# Altium schematic sheet LB-word-oscillator.SchDoc
size A4
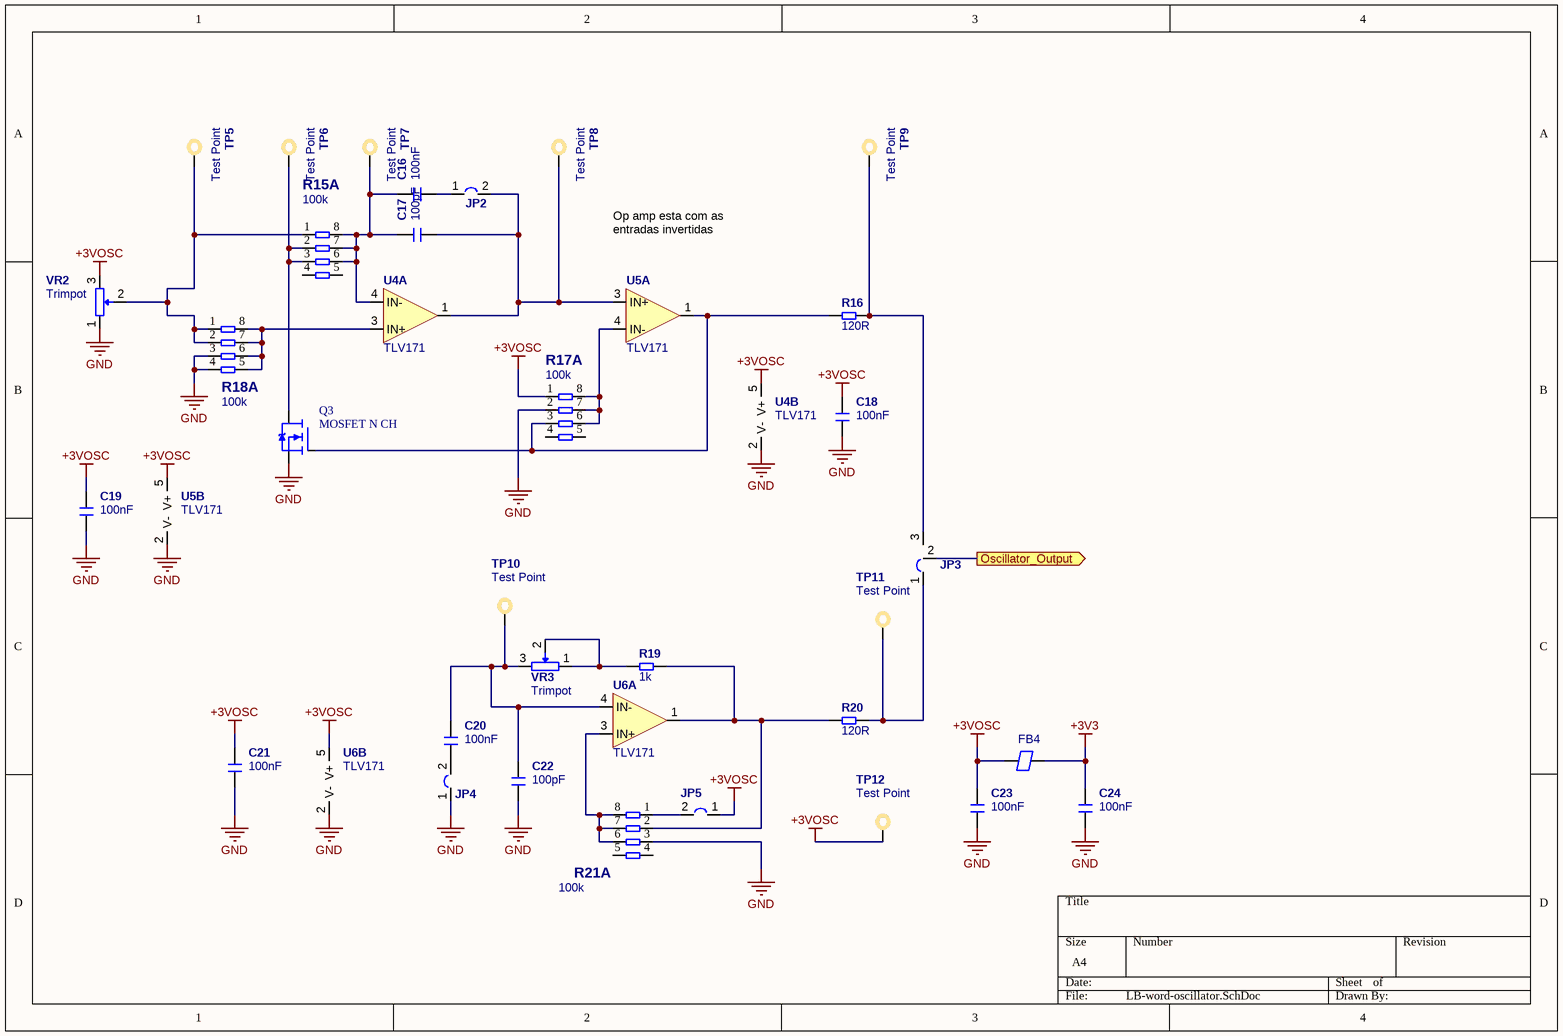
[diagram p0: LB-word-oscillator.SchDoc]

## Parts
C16  100nF  [C0603_N]
C17  100pF  [C0603_N]
C18  100nF  [C0603_N]
C19  100nF  [C0603_N]
C20  100nF  [C0603_N]
C21  100nF  [C0603_N]
C22  100pF  [C0603_N]
C23  100nF  [C0603_N]
C24  100nF  [C0603_N]
FB4  Ferrite Bead  [F0603_N]  (value not drawn)
JP2  Jumper 2W  [Jumper SMD 2W NO]  (value not drawn)
JP3  Jumper 3W  [Jumper SMD 3W NO]  (value not drawn)
JP4  Jumper 2W  [Jumper SMD 2W NO]  (value not drawn)
JP5  Jumper 2W  [Jumper SMD 2W NO]  (value not drawn)
Q3  MOSFET N CH  [SOT23_N]
R15  value 100k  [YC164]  (parts A,B,C,D of 4)
R16  120R  [R0603]
R17  value 100k  [YC164]  (parts A,B,C,D of 4)
R18  value 100k  [YC164]  (parts A,B,C,D of 4)
R19  1k  [R0603]
R20  120R  [R0603]
R21  value 100k  [YC164]  (parts A,B,C,D of 4)
TP5  Test Point  [TestPoint-1.2mm]
TP6  Test Point  [TestPoint-1.2mm]
TP7  Test Point  [TestPoint-1.2mm]
TP8  Test Point  [TestPoint-1.2mm]
TP9  Test Point  [TestPoint-1.2mm]
TP10  Test Point  [TestPoint-1.2mm]
TP11  Test Point  [TestPoint-1.2mm]
TP12  Test Point  [TestPoint-1.2mm]
U4  TLV171  [SOT23-5_N]  (parts A,B of 2)
U5  TLV171  [SOT23-5_N]  (parts A,B of 2)
U6  TLV171  [SOT23-5_N]  (parts A,B of 2)
VR2  Trimpot  [Trimpot 3314]
VR3  Trimpot  [Trimpot 3314]

## Ports
Oscillator_Output (out)

## Nets
+3V3: C24.1 FB4.2
+3VOSC: C18.1 C19.1 C21.1 C23.1 FB4.1 JP5.1 R17.1 TP12.1 U4.5(V+) U5.5(V+) U6.5(V+) VR2.3
GND: C18.2 C19.2 C21.2 C22.2 C23.2 C24.2 JP4.1 Q3.3(S) R17.3 R17.4 R18.2 R21.3 U4.2(V-) U5.2(V-) U6.2(V-) VR2.1
Oscillator_Output: JP3.2 ; port Oscillator_Output
NetC16_1: C16.1 C17.1 R15.6 R15.7 R15.8 TP7.1 U4.4(IN-)
NetC16_2: C16.2 JP2.1
NetC17_2: C17.2 JP2.2 TP8.1 U4.1(OUT) U5.3(IN+)
NetC20_1: C20.1 C22.1 TP10.1 U6.4(IN-) VR3.3
NetC20_2: C20.2 JP4.2
NetJP3_1: JP3.1 R20.2 TP11.1
NetJP3_3: JP3.3 R16.2 TP9.1
NetJP5_2: JP5.2 R21.1
NetQ3_1: Q3.1(G) R16.1 R18.3 U5.1(OUT)
NetQ3_2: Q3.2(D) R15.2 R15.3 TP6.1
NetR15_1: R15.1 R17.2 R18.1 TP5.1 VR2.2
NetR17_5: R17.5 R17.6 R17.7 R18.8 U4.3(IN+)
NetR17_8: R17.8 R18.6 R18.7 U5.4(IN-)
NetR19_1: R19.1 VR3.1 VR3.2
NetR19_2: R19.2 R20.1 R21.2 U6.1(OUT)
NetR21_6: R21.6 R21.7 R21.8 U6.3(IN+)

Not connected (* = marked no-connect by the designer): R15 4 5; R18 4 5; R21 4 5

## Notes on the sheet
- (near U5) Op amp esta com as entradas invertidas

## Library data of the parts
C16-C24 = Capacitor: Capacitor MLCC; Manufacturer: Yageo; Manufacturer Part Number: CC0603KRX7R9BB104; Tolerance (%): 10; Category: Capacitor; Package: 0603; Supplier Part Number 1: 1362556; Supplier 1: Farnell; ComponentLink1URL: http://www.yageo.com; ComponentLink1Description: Manufacturer Website; Voltage Rating (Volts): *; Supplier 2: Digi-Key; Supplier Part Number 2: 311-1344-1-ND
  C16 C18-C21 C23 C24: Value: 100nF
  C17 C22: Value: 100pF
R15 R17 R18 R21 = Resistor Array - 4P
R16 R19 R20 = Resistor: Published: 17-Dec-2003; LatestRevisionDate: 19-Mar-2004; LatestRevisionNote: Silkscreen size reduced.; PackageDocument: Mar-2003; PackageReference: 3-0603; Publisher: Altium Limited; Code_IPC: 1608 [0603]; ComponentLink1Description: Manufacturer Link; ComponentLink1URL: http://www.panasonic.com/industrial/components/resistive_products.htm; ComponentLink2Description: Datasheet; ComponentLink2URL: http://www.panasonic.com/industrial/components/pdf/AOA0000CE2.pdf
  R16 R20: Value: 120R
  R19: Value: 1k
U4-U6 = TLV171: Single RRO Opamp